# EAGLE design bottoni (EAGLE 6.1)
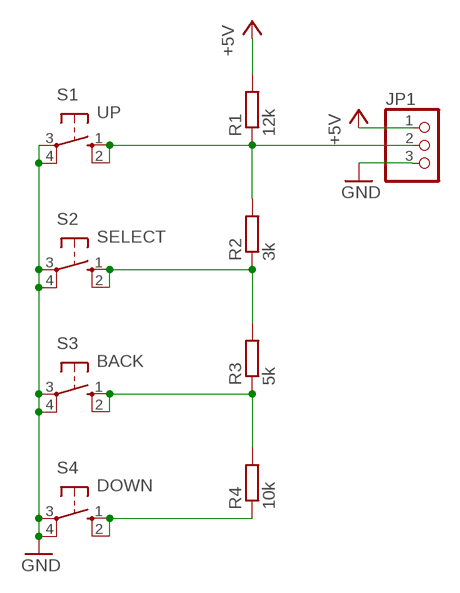
[diagram p0: schematic, sheet 1]

## Parts
JP1  PINHD-1X3/90  [1X03/90]
R1  12k  R-EU_0207/10  [0207/10]
R2  3k  R-EU_0207/10  [0207/10]
R3  5k  R-EU_0207/10  [0207/10]
R4  10k  R-EU_0207/10  [0207/10]
S1  UP  10-XX  [B3F-10XX]
S2  SELECT  10-XX  [B3F-10XX]
S3  BACK  10-XX  [B3F-10XX]
S4  DOWN  10-XX  [B3F-10XX]

## Nets
+5V: JP1.1 R1.2
GND: JP1.3 S1.3(P) S1.4(P1) S2.3(P) S2.4(P1) S3.3(P) S3.4(P1) S4.3(P) S4.4(P1)
N$1: JP1.2 R1.1 R2.2 S1.1(S) S1.2(S1)
N$2: R2.1 R3.2 S2.1(S) S2.2(S1)
N$3: R3.1 R4.2 S3.1(S) S3.2(S1)
N$4: R4.1 S4.1(S) S4.2(S1)

## Library data of the parts
JP1 = pinhead:PINHD-1X3: PIN HEADER
R1-R4 = rcl:R-EU_: RESISTOR, European symbol
S1-S4 = switch-omron:10-XX: OMRON SWITCH; MPN: B3F-1000; OC_FARNELL: 176432; OC_NEWARK: 36M3542

## Board
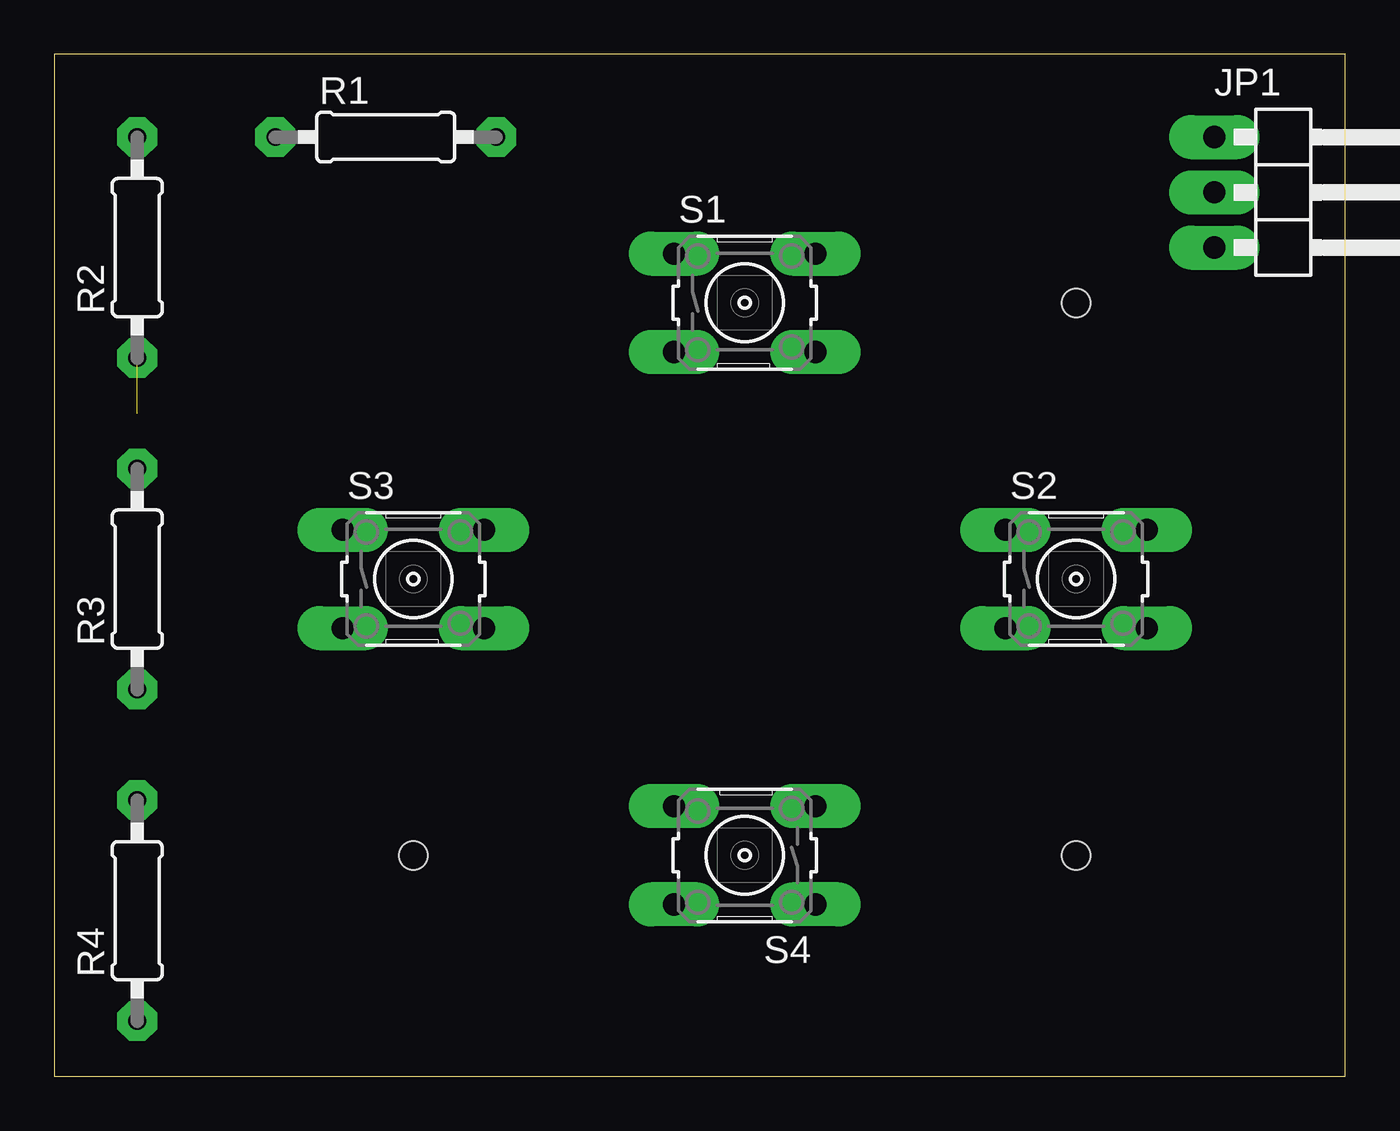
[diagram p1: board, top side]
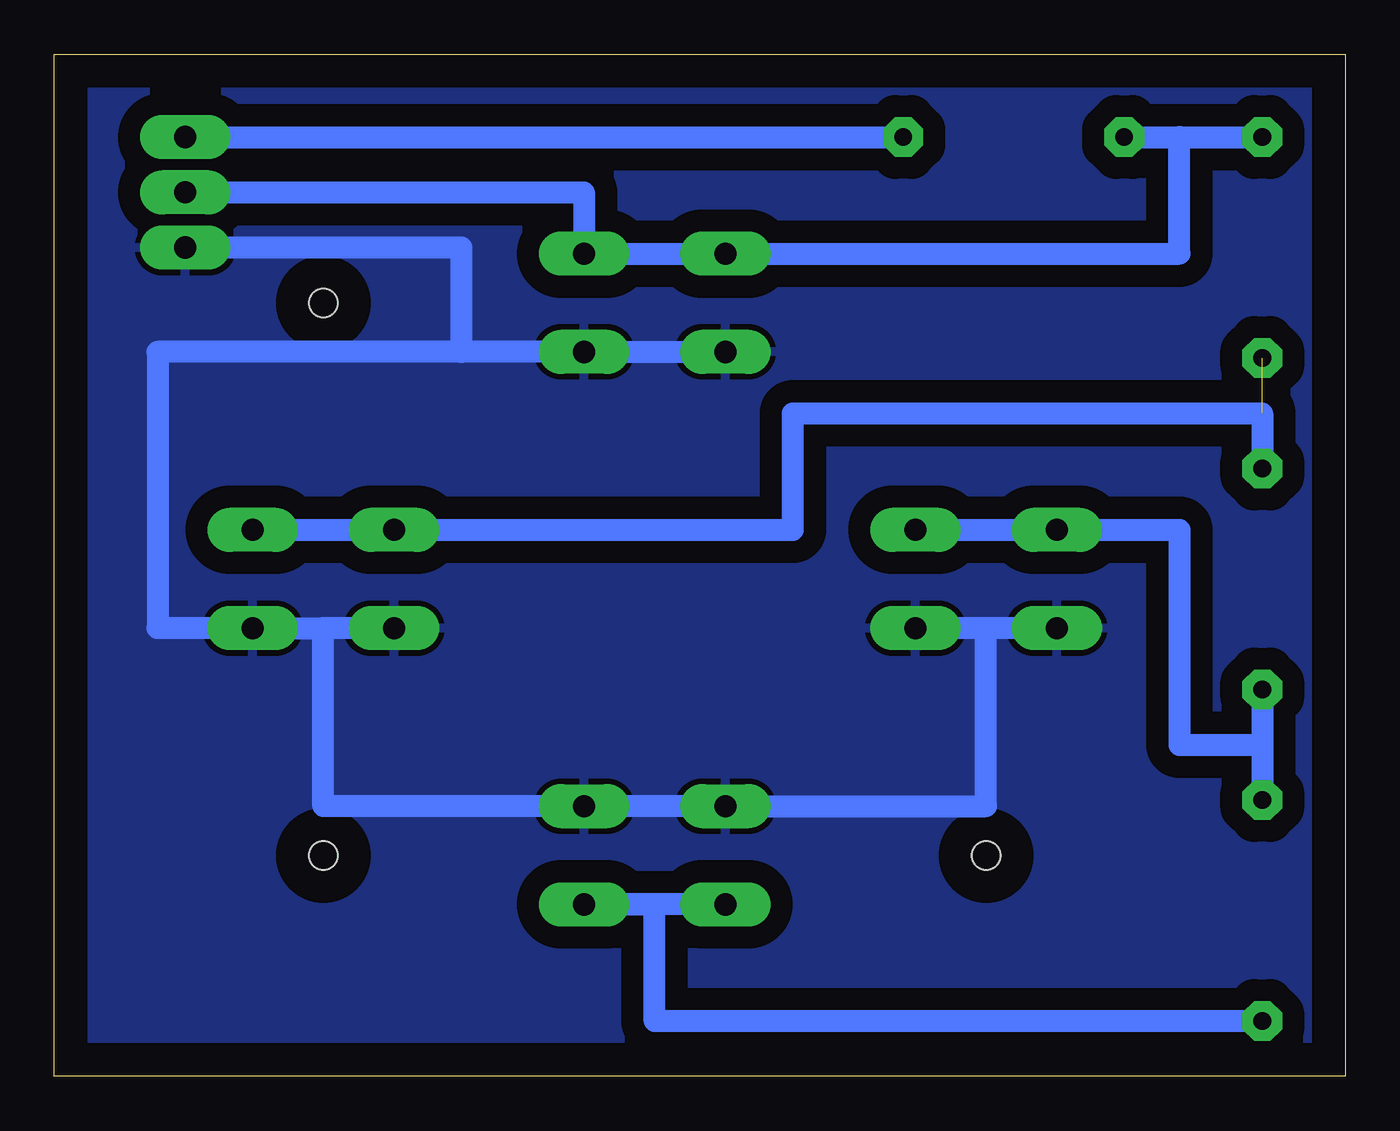
[diagram p2: board, bottom side, seen from below]

Size 59.36 x 46.98 mm. Coordinates in mm from the lower left corner, seen from the top.
Outline: 0,0 59.36,0 59.36,46.98 0,46.98 0,0
Copper layers (1*16): Top 0.035mm / dielectric 1.5mm / Bottom 0.035mm
Design rules: minimum track width 40mil, minimum drill 24mil, track to track 40mil, track to pad 40mil, pad to pad 20mil, via to via 40mil, smd to smd 10mil, copper to edge 60mil, drill to drill 20mil, minimum pad ring 20mil, minimum via ring 20mil, stop-mask expansion 4mil, vias tented up to drill 0mil, thermal gap 10mil
Holes 1.3 mm at 46.99,35.56 16.51,10.16 46.99,10.16

### Footprints (pad centres in the part's own frame; a part is rotated, then mirrored left to right if it is on the bottom)
1X03/90 = drill 1.016 long: 1 -2.54,-3.81; 2 0,-3.81; 3 2.54,-3.81
0207/10 = drill 0.813 octagon: 1 -5.08,0; 2 5.08,0
B3F-10XX = drill 1.016 long: 1 -3.251,2.261; 2 3.251,2.261; 3 -3.251,-2.261; 4 3.251,-2.261

### Placement (x,y rotation side)
JP1  57.15,40.64 270 top
R1  15.24,43.18 0 top
R2  3.81,38.1 90 top
R3  3.81,22.86 90 top
R4  3.81,7.62 90 top
S1  31.75,35.56 0 top
S2  46.99,22.86 0 top
S3  16.51,22.86 0 top
S4  31.75,10.16 180 top

### Tracks (layer width: path | path; a pad name or v marks a point on that pad's centre or on a via)
+5V
  Bottom 1.016: JP1.1 R1.2
GND
  Bottom 1.016: S3.3 16.51,20.6 | 16.51,20.6 S3.4 | S1.3 S1.4 40.64,33.3 | 16.51,20.6 16.51,12.42 S4.4 S4.3 46.99,12.42 46.99,20.6 | S2.3 46.99,20.6 | 40.64,33.3 40.64,38.1 JP1.3 | 46.99,20.6 S2.4 54.61,20.6 54.61,33.3 40.64,33.3
  pour Bottom: 0,0 59.69,0 59.69,46.99 0,46.99
N$1
  Bottom 1.016: R1.1 7.62,43.18 | 7.62,43.18 R2.2 | JP1.2 35,40.64 S1.2 S1.1 7.62,37.82 7.62,43.18
N$2  (1 unrouted)
  Bottom 1.016: R3.2 3.81,30.48 25.4,30.48 25.4,25.12 S2.1 S2.2
N$3
  Bottom 1.016: S3.2 S3.1 7.62,25.12 7.62,15.24 3.81,15.24 | R3.1 3.81,15.24 | 3.81,15.24 R4.2
N$4
  Bottom 1.016: R4.1 31.75,2.54 31.75,7.9 S4.1 S4.2